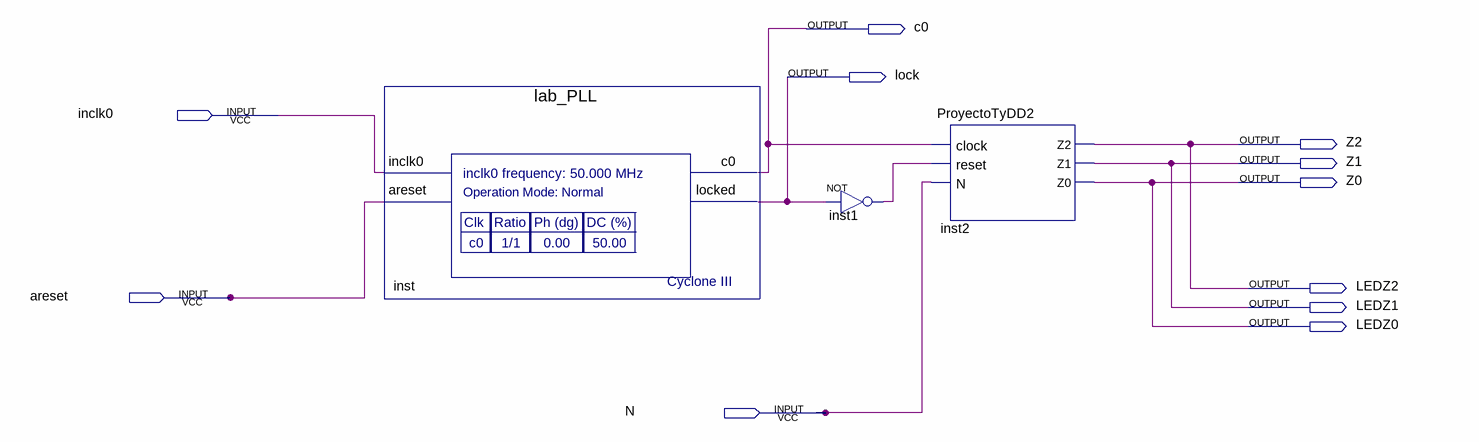
[diagram p0: schematic sheet]
// Quartus schematic Completo.bdf as structural Verilog: 3 symbols, 11 pins
module Completo (
  input  inclk0,
  input  areset,
  input  N,
  output c0,
  output lock,
  output Z2,
  output Z1,
  output Z0,
  output LEDZ2,
  output LEDZ1,
  output LEDZ0
);

  wire inst1_out;

  lab_PLL inst (.inclk0(inclk0), .areset(areset), .c0(c0), .locked(lock));
  not inst1 (inst1_out, lock);
  ProyectoTyDD2 inst2 (.clock(c0), .reset(inst1_out), .N(N), .Z2(LEDZ2), .Z1(LEDZ1), .Z0(LEDZ0));

  assign Z0 = LEDZ0;
  assign Z1 = LEDZ1;
  assign Z2 = LEDZ2;
endmodule
